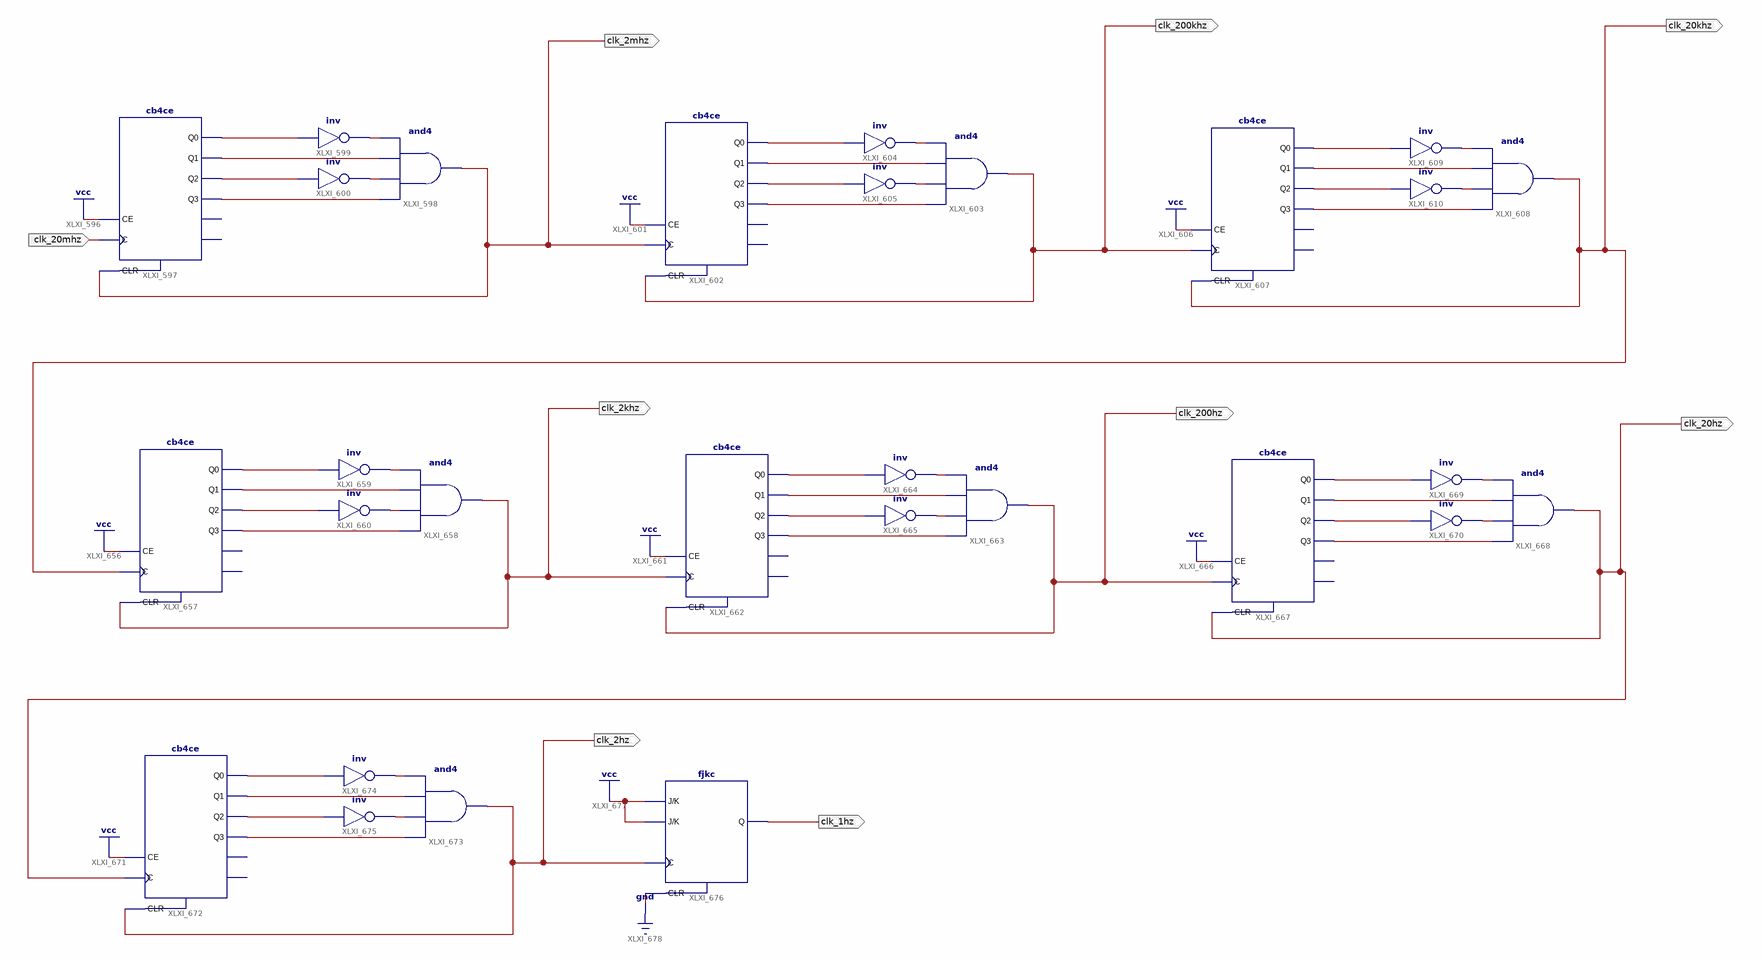
[diagram p0: schematic sheet 1]
// Xilinx ISE schematic CLK_Moded.sch (spartan6) as structural Verilog: 29 symbols, 9 ports
module CLK_Moded (
  input  clk_20mhz,
  output clk_2mhz,
  output clk_200khz,
  output clk_2khz,
  output clk_200hz,
  output clk_2hz,
  output clk_20khz,
  output clk_20hz,
  output clk_1hz
);

  wire XLXN_1065, XLXN_1066, XLXN_1068, XLXN_1069, XLXN_1070, XLXN_1071, XLXN_1073, XLXN_1074, XLXN_1076,
       XLXN_1077, XLXN_1078, XLXN_1079, XLXN_1082, XLXN_1083, XLXN_1085, XLXN_1086, XLXN_1087, XLXN_1088,
       XLXN_1172, XLXN_1173, XLXN_1175, XLXN_1176, XLXN_1177, XLXN_1178, XLXN_1181, XLXN_1182, XLXN_1184,
       XLXN_1185, XLXN_1186, XLXN_1187, XLXN_1190, XLXN_1191, XLXN_1193, XLXN_1194, XLXN_1195, XLXN_1196,
       XLXN_1199, XLXN_1200, XLXN_1202, XLXN_1203, XLXN_1204, XLXN_1205;

  cb4ce XLXI_597 (
    .C(clk_20mhz), .CE(1'b1), .CLR(clk_2mhz), .Q0(XLXN_1068), .Q1(XLXN_1069), .Q2(XLXN_1070), .Q3(XLXN_1071));  // open: CEO, TC
  and XLXI_598 (clk_2mhz, XLXN_1071, XLXN_1066, XLXN_1069, XLXN_1065);
  not XLXI_599 (XLXN_1065, XLXN_1068);
  not XLXI_600 (XLXN_1066, XLXN_1070);
  cb4ce XLXI_602 (
    .C(clk_2mhz), .CE(1'b1), .CLR(clk_200khz), .Q0(XLXN_1076), .Q1(XLXN_1077), .Q2(XLXN_1078), .Q3(XLXN_1079));  // open: CEO, TC
  and XLXI_603 (clk_200khz, XLXN_1079, XLXN_1074, XLXN_1077, XLXN_1073);
  not XLXI_604 (XLXN_1073, XLXN_1076);
  not XLXI_605 (XLXN_1074, XLXN_1078);
  cb4ce XLXI_607 (
    .C(clk_200khz), .CE(1'b1), .CLR(clk_20khz), .Q0(XLXN_1085), .Q1(XLXN_1086), .Q2(XLXN_1087), .Q3(XLXN_1088));  // open: CEO, TC
  and XLXI_608 (clk_20khz, XLXN_1088, XLXN_1083, XLXN_1086, XLXN_1082);
  not XLXI_609 (XLXN_1082, XLXN_1085);
  not XLXI_610 (XLXN_1083, XLXN_1087);
  cb4ce XLXI_657 (
    .C(clk_20khz), .CE(1'b1), .CLR(clk_2khz), .Q0(XLXN_1175), .Q1(XLXN_1176), .Q2(XLXN_1177), .Q3(XLXN_1178));  // open: CEO, TC
  and XLXI_658 (clk_2khz, XLXN_1178, XLXN_1173, XLXN_1176, XLXN_1172);
  not XLXI_659 (XLXN_1172, XLXN_1175);
  not XLXI_660 (XLXN_1173, XLXN_1177);
  cb4ce XLXI_662 (
    .C(clk_2khz), .CE(1'b1), .CLR(clk_200hz), .Q0(XLXN_1184), .Q1(XLXN_1185), .Q2(XLXN_1186), .Q3(XLXN_1187));  // open: CEO, TC
  and XLXI_663 (clk_200hz, XLXN_1187, XLXN_1182, XLXN_1185, XLXN_1181);
  not XLXI_664 (XLXN_1181, XLXN_1184);
  not XLXI_665 (XLXN_1182, XLXN_1186);
  cb4ce XLXI_667 (
    .C(clk_200hz), .CE(1'b1), .CLR(clk_20hz), .Q0(XLXN_1193), .Q1(XLXN_1194), .Q2(XLXN_1195), .Q3(XLXN_1196));  // open: CEO, TC
  and XLXI_668 (clk_20hz, XLXN_1196, XLXN_1191, XLXN_1194, XLXN_1190);
  not XLXI_669 (XLXN_1190, XLXN_1193);
  not XLXI_670 (XLXN_1191, XLXN_1195);
  cb4ce XLXI_672 (
    .C(clk_20hz), .CE(1'b1), .CLR(clk_2hz), .Q0(XLXN_1202), .Q1(XLXN_1203), .Q2(XLXN_1204), .Q3(XLXN_1205));  // open: CEO, TC
  and XLXI_673 (clk_2hz, XLXN_1205, XLXN_1200, XLXN_1203, XLXN_1199);
  not XLXI_674 (XLXN_1199, XLXN_1202);
  not XLXI_675 (XLXN_1200, XLXN_1204);
  fjkc XLXI_676 (.C(clk_2hz), .CLR(1'b0), .J(1'b1), .K(1'b1), .Q(clk_1hz));
endmodule
